# EAGLE design Power_3Escon_board_v2 (EAGLE 9.6.2)
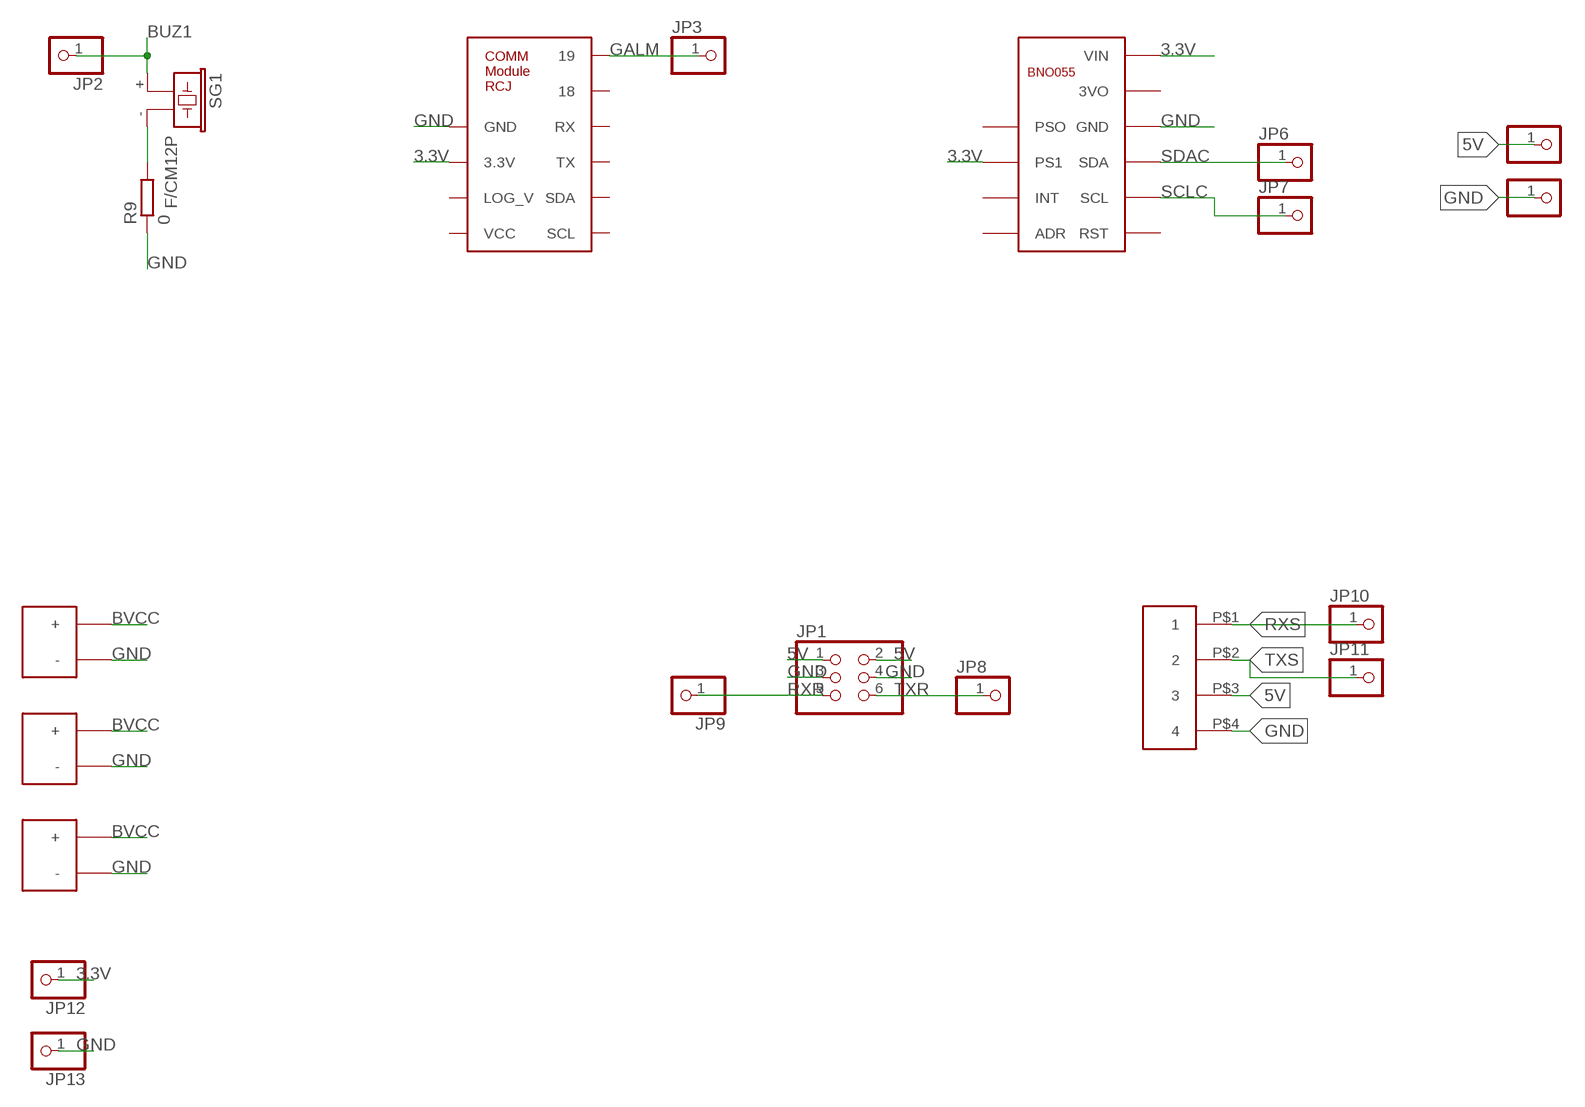
[diagram p0: schematic, sheet 1, part 1 of 3]
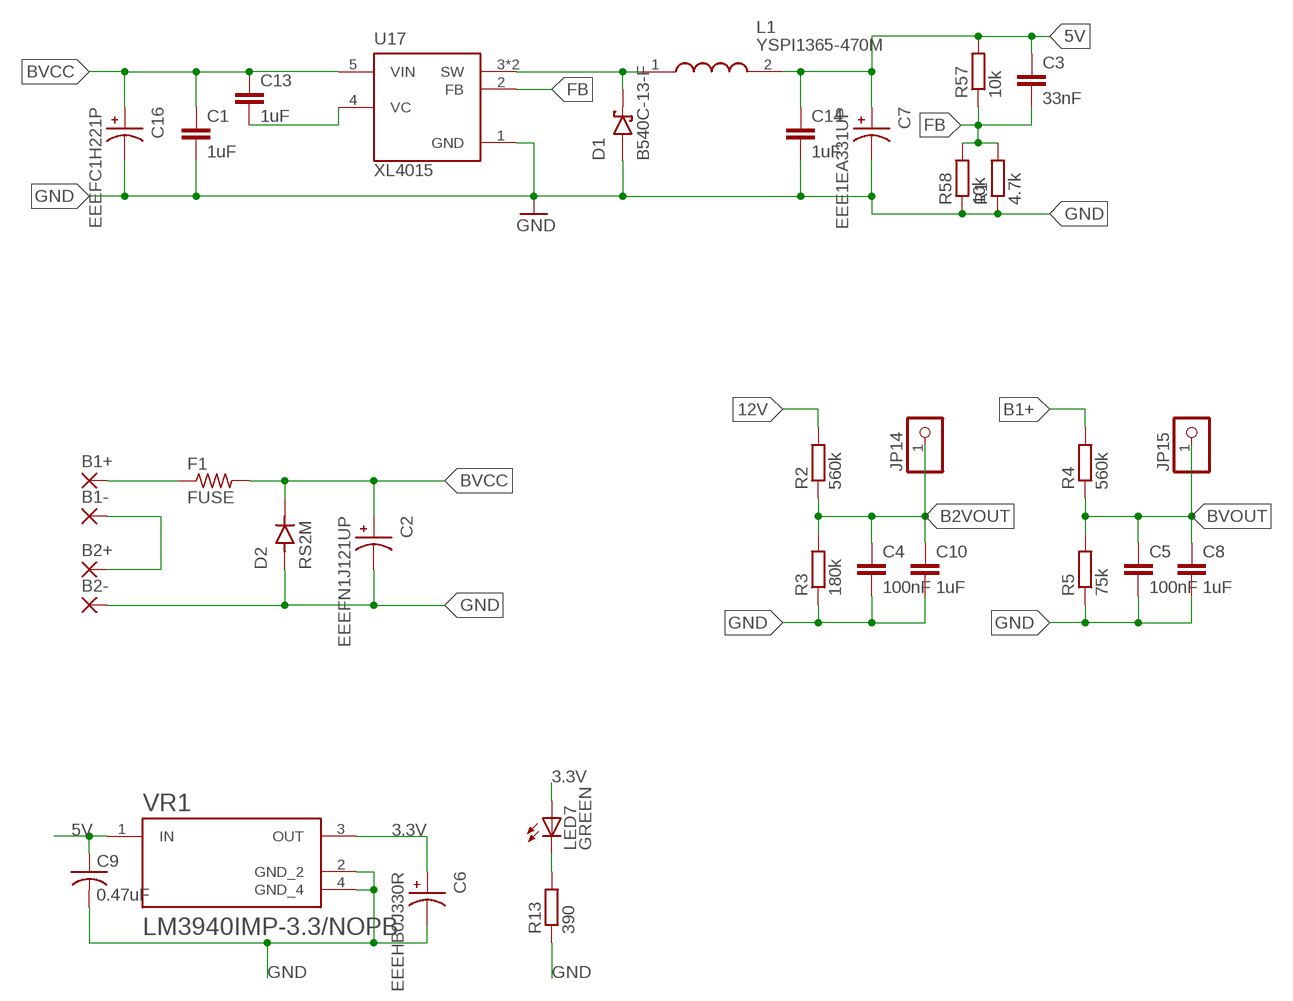
[diagram p1: schematic, sheet 1, part 2 of 3]
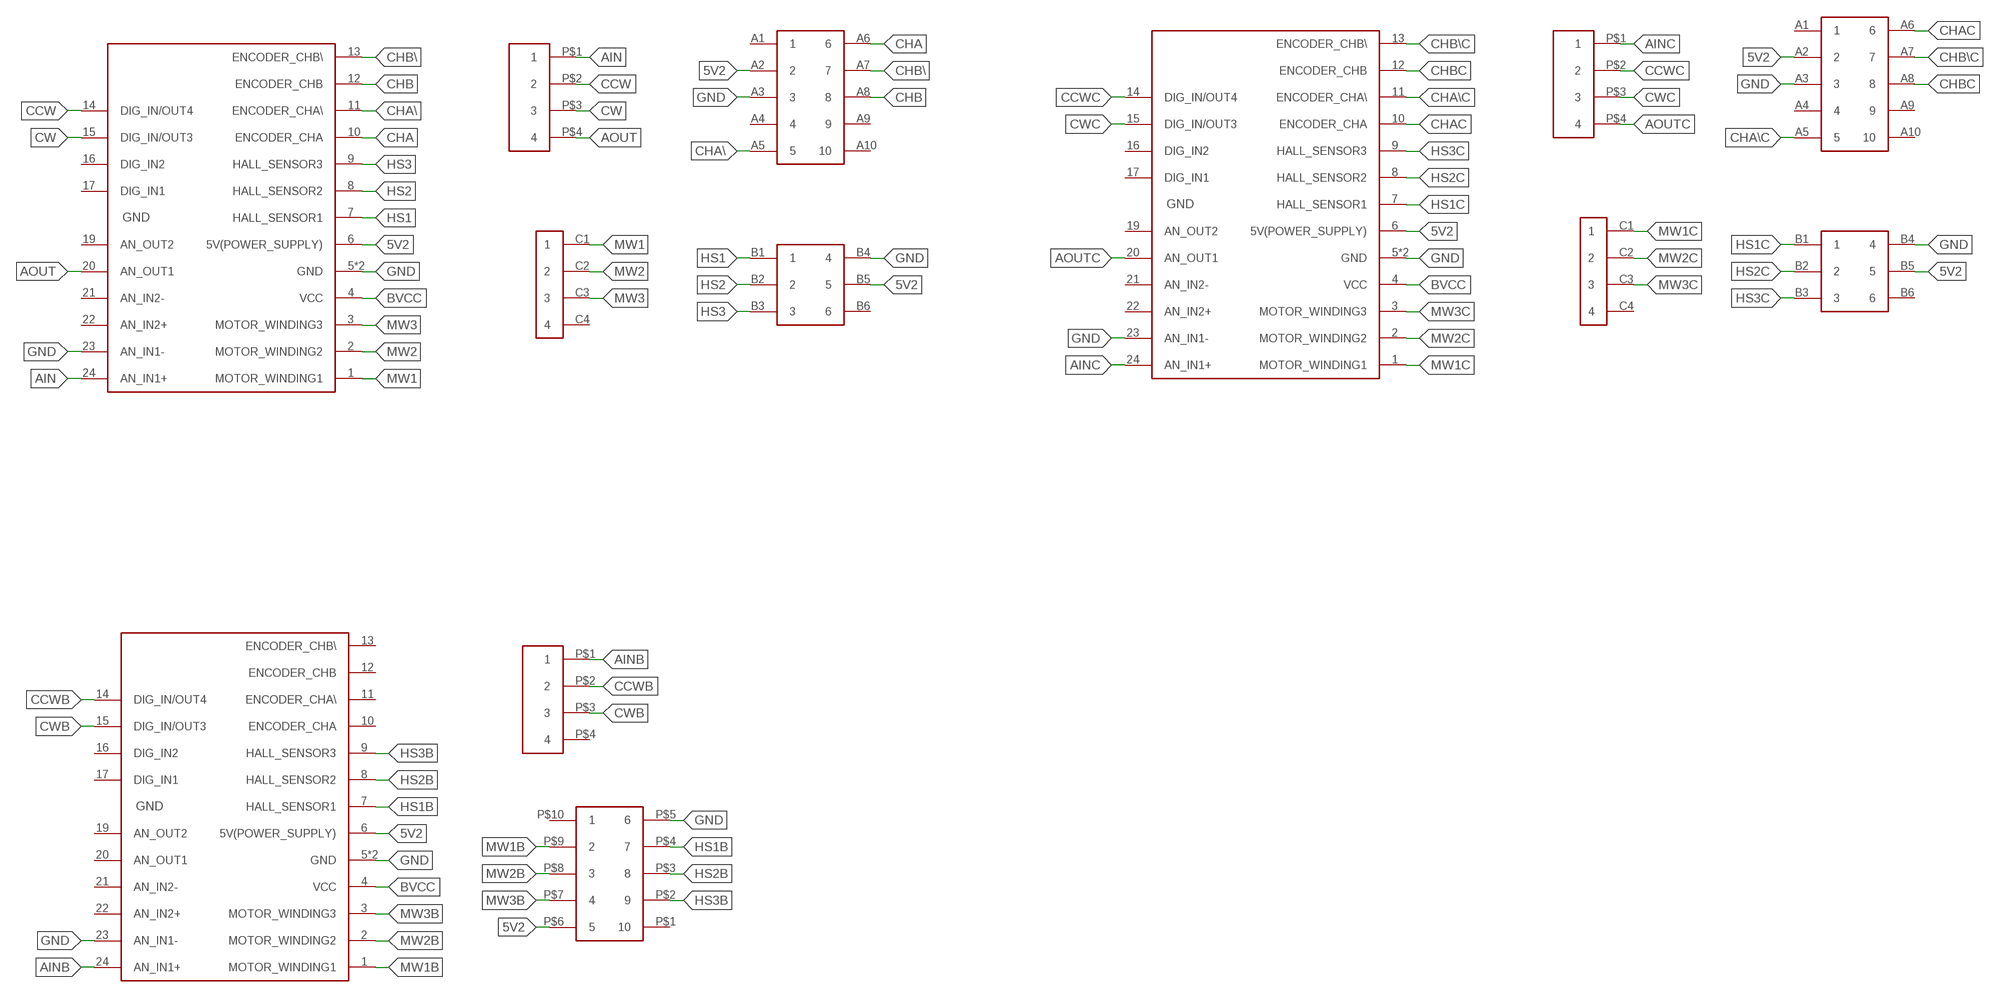
[diagram p2: schematic, sheet 1, part 3 of 3]

## Parts
B1+  3,81/1,4  [3,81/1,4]
B1-  3,81/1,4  [3,81/1,4]
B2+  3,81/1,4  [3,81/1,4]
B2-  3,81/1,4  [3,81/1,4]
C1  1uF  C-EUC0603  [C0603]
C2  EEEFN1J121UP  [CAP_EEEFN1J121UP]
C3  33nF  C-EUC0603  [C0603]
C4  100nF  C-EUC0603  [C0603]
C5  100nF  C-EUC0603  [C0603]
C6  EEEHB0J330R  [CAP_EEEHB0J330R]
C7  EEE1EA331UP  [CAP_EEE1EA331UP]
C8  1uF  C-EUC0603  [C0603]
C9  0.47uF  C-USC0603  [C0603]
C10  1uF  C-EUC0603  [C0603]
C13  1uF  C-EUC0603  [C0603]
C14  1uF  C-EUC0603  [C0603]
C16  EEEFC1H221P  [CAP_EEEFC1H221P]
D1  B540C-13-F  [DIOM6959X245N]
D2  RS2M  [DIOM4336X265N]
F1  FUSE  R-US_R1206  [R1206]
JP1  PINHD-2X3  [2X03]
JP2  PINHD-1X1  [1X01]
JP3  PINHD-1X1  [1X01]
JP4  PINHD-1X1  [1X01]
JP5  PINHD-1X1  [1X01]
JP6  PINHD-1X1  [1X01]
JP7  PINHD-1X1  [1X01]
JP8  PINHD-1X1  [1X01]
JP9  PINHD-1X1  [1X01]
JP10  PINHD-1X1  [1X01]
JP11  PINHD-1X1  [1X01]
JP12  PINHD-1X1  [1X01]
JP13  PINHD-1X1  [1X01]
JP14  PINHD-1X1  [1X01]
JP15  PINHD-1X1  [1X01]
L1  YSPI1365-470M  [INDPM138126X650N]
LED7  GREEN  LEDCHIPLED_0603  [CHIPLED_0603]
R1  4.7k  R-EU_R0603  [R0603]
R2  560k  R-EU_R0603  [R0603]
R3  180k  R-EU_R0603  [R0603]
R4  560k  R-EU_R0603  [R0603]
R5  75k  R-EU_R0603  [R0603]
R9  0  R-EU_R0603  [R0603]
R13  390  R-EU_R0603  [R0603]
R57  10k  R-EU_R0603  [R0603]
R58  10k  R-EU_R0603  [R0603]
SG1  F/CM12P  [F/CM12P]
U17  XL4015  [CONV_XL4015]
U$1  ESCON24/224/2  [ESCON24/2]
U$2  GAL_MODULE  [GAL_MODULE]
U$3  BNO055  [BNO055]
U$4  280378-2CONNECTOR  [280378-2CONNECTOR]
U$5  PIN2.54-2X5  [PIN2.54-2X5]
U$6  MX-44914-0601  [MX-44914-0601]
U$7  MX5566  [MX5566]
U$10  ESCON24/224/2  [ESCON24/2]
U$13  280378-2CONNECTOR  [280378-2CONNECTOR]
U$14  2,5MSF10  [2,5MSF10]
U$15  ESCON24/224/2  [ESCON24/2]
U$16  280378-2CONNECTOR  [280378-2CONNECTOR]
U$17  PIN2.54-2X5  [PIN2.54-2X5]
U$18  MX-44914-0601  [MX-44914-0601]
U$19  MX5566  [MX5566]
U$22  280378-2CONNECTOR  [280378-2CONNECTOR]
U$23  SVORKOVNICA3.5_P2  [SVORKOVNICA3.5]
U$24  SVORKOVNICA3.5_P2  [SVORKOVNICA3.5]
U$25  SVORKOVNICA3.5_P2  [SVORKOVNICA3.5]
VR1  LM3940IMP-3.3/NOPB  [VREG_LM3940IMP-3.3/NOPB]

## Nets
3.3V: C6.1 JP12.1 LED7.A U$2.3.3V U$3.PS1 U$3.VIN VR1.3(OUT)
5V: C3.1 C7.1 C9.1 C14.1 JP1.1 JP1.2 JP4.1 L1.2 R57.2 U$22.P$3 VR1.1(IN)
5V2: U$1.6(5V(POWER_SUPPLY)) U$5.A2 U$6.B5 U$10.6(5V(POWER_SUPPLY)) U$14.P$6 U$15.6(5V(POWER_SUPPLY)) U$17.A2 U$18.B5
12V: B1-.1(P) B2+.1(P) R2.2
AIN: U$1.24(AN_IN1+) U$4.P$1
AINB: U$10.24(AN_IN1+) U$13.P$1
AINC: U$15.24(AN_IN1+) U$16.P$1
AOUT: U$1.20(AN_OUT1) U$4.P$4
AOUTC: U$15.20(AN_OUT1) U$16.P$4
B1+: B1+.1(P) F1.1 R4.2
B2VOUT: C4.1 C10.1 JP14.1 R2.1 R3.2
BUZ1: JP2.1 SG1.+
BVCC: C1.1 C2.1 C13.1 C16.1 D2.C(K) F1.2 U17.5(VIN) U$1.4(VCC) U$10.4(VCC) U$15.4(VCC) U$23.P$1(+) U$24.P$1(+) U$25.P$1(+)
BVOUT: C5.1 C8.1 JP15.1 R4.1 R5.2
CCW: U$1.14(DIG_IN/OUT4) U$4.P$2
CCWB: U$10.14(DIG_IN/OUT4) U$13.P$2
CCWC: U$15.14(DIG_IN/OUT4) U$16.P$2
CHA: U$1.10(ENCODER_CHA) U$5.A6
CHA\\: U$1.11(ENCODER_CHA\\) U$5.A5
CHA\\C: U$15.11(ENCODER_CHA\\) U$17.A5
CHAC: U$15.10(ENCODER_CHA) U$17.A6
CHB: U$1.12(ENCODER_CHB) U$5.A8
CHB\\: U$1.13(ENCODER_CHB\\) U$5.A7
CHB\\C: U$15.13(ENCODER_CHB\\) U$17.A7
CHBC: U$15.12(ENCODER_CHB) U$17.A8
CW: U$1.15(DIG_IN/OUT3) U$4.P$3
CWB: U$10.15(DIG_IN/OUT3) U$13.P$3
CWC: U$15.15(DIG_IN/OUT3) U$16.P$3
FB: C3.2 R1.2 R57.1 R58.2 U17.2(FB)
GALM: JP3.1 U$2.19
GND: B2-.1(P) C1.2 C2.2 C4.2 C5.2 C6.2 C7.2 C8.2 C9.2 C10.2 C14.2 C16.2 D1.A D2.A JP1.3 JP1.4 JP5.1 JP13.1 R1.1 R3.1 R5.1 R9.1 R13.1 R58.1 U17.1(GND) U$1.5(GND) U$1.18(GND) U$1.23(AN_IN1-) U$2.GND U$3.GND U$5.A3 U$6.B4 U$10.5(GND) U$10.18(GND) U$10.23(AN_IN1-) U$14.P$5 U$15.5(GND) U$15.18(GND) U$15.23(AN_IN1-) U$17.A3 U$18.B4 U$22.P$4 U$23.P$2(-) U$24.P$2(-) U$25.P$2(-) VR1.2(GND_2) VR1.4(GND_4)
HS1: U$1.7(HALL_SENSOR1) U$6.B1
HS1B: U$10.7(HALL_SENSOR1) U$14.P$4
HS1C: U$15.7(HALL_SENSOR1) U$18.B1
HS2: U$1.8(HALL_SENSOR2) U$6.B2
HS2B: U$10.8(HALL_SENSOR2) U$14.P$3
HS2C: U$15.8(HALL_SENSOR2) U$18.B2
HS3: U$1.9(HALL_SENSOR3) U$6.B3
HS3B: U$10.9(HALL_SENSOR3) U$14.P$2
HS3C: U$15.9(HALL_SENSOR3) U$18.B3
MW1: U$1.1(MOTOR_WINDING1) U$7.C1
MW1B: U$10.1(MOTOR_WINDING1) U$14.P$9
MW1C: U$15.1(MOTOR_WINDING1) U$19.C1
MW2: U$1.2(MOTOR_WINDING2) U$7.C2
MW2B: U$10.2(MOTOR_WINDING2) U$14.P$8
MW2C: U$15.2(MOTOR_WINDING2) U$19.C2
MW3: U$1.3(MOTOR_WINDING3) U$7.C3
MW3B: U$10.3(MOTOR_WINDING3) U$14.P$7
MW3C: U$15.3(MOTOR_WINDING3) U$19.C3
N$5: LED7.C R13.2
N$7: C13.2 U17.4(VC)
N$16: R9.2 SG1.-
N$42: D1.C(K) L1.1 U17.3(SW) U17.3.1(SW)
RXR: JP1.5 JP9.1
RXS: JP10.1 U$22.P$1
SCLC: JP7.1 U$3.SCL
SDAC: JP6.1 U$3.SDA
TXR: JP1.6 JP8.1
TXS: JP11.1 U$22.P$2
Unconnected: U$1.16(DIG_IN2) U$1.17(DIG_IN1) U$1.19(AN_OUT2) U$1.21(AN_IN2-) U$1.22(AN_IN2+) U$2.18 U$2.LOG_VCC(LOG_V) U$2.RX U$2.SCL U$2.SDA U$2.TX U$2.VCC U$3.3VO U$3.ADR U$3.INT U$3.PS0(PSO) U$3.RST U$5.A1 U$5.A4 U$5.A9 U$5.A10 U$6.B6 U$7.C4 U$10.10(ENCODER_CHA) U$10.11(ENCODER_CHA\\) U$10.12(ENCODER_CHB) U$10.13(ENCODER_CHB\\) U$10.16(DIG_IN2) U$10.17(DIG_IN1) U$10.19(AN_OUT2) U$10.20(AN_OUT1) U$10.21(AN_IN2-) U$10.22(AN_IN2+) U$13.P$4 U$14.P$1 U$14.P$10 U$15.16(DIG_IN2) U$15.17(DIG_IN1) U$15.19(AN_OUT2) U$15.21(AN_IN2-) U$15.22(AN_IN2+) U$17.A1 U$17.A4 U$17.A9 U$17.A10 U$18.B6 U$19.C4

## Library data of the parts
B1+ B1- B2+ B2- = wirepad:3,81/1,4: THROUGH-HOLE PAD
C1 C3-C5 C8 C10 C13 C14 = rcl:C-EU: CAPACITOR, European symbol; SPICEPREFIX: C
C2 = EEEFN1J121UP:EEEFN1J121UP: Check availability <https://pricing.snapeda.com/parts/EEE-FN1J121UP/Panasonic%20Electronic%20Components/view-part?ref=eda>; AVAILABILITY: In Stock; CHECK_PRICES: https://www.snapeda.com/parts/EEE-FN1J121UP/Panasonic/view-part/?ref=eda; DESCRIPTION: Capacitor,63VDC, 120uF,SMD'Electrolytic | Panasonic Electronic Components EEE-FN1J121UP; MF: Panasonic Electronic Components; MP: EEE-FN1J121UP; PACKAGE: RADIAL-2 Panasonic; PRICE: None; PURCHASE-URL: https://www.snapeda.com/api/url_track_click_mouser/?unipart_id=4878607&manufacturer=Panasonic Electronic Components&part_name=EEE-FN1J121UP&search_term=eeefn1j121up; SNAPEDA_LINK: https://www.snapeda.com/parts/EEE-FN1J121UP/Panasonic/view-part/?ref=snap
C6 = EEEHB0J330R:EEEHB0J330R: Check availability <https://pricing.snapeda.com/parts/EEE-HB0J330R/Panasonic/view-part?ref=eda>; AVAILABILITY: In Stock; CHECK_PRICES: https://www.snapeda.com/parts/EEE-HB0J330R/Panasonic/view-part/?ref=eda; DESCRIPTION: Capacitor,Alum Electrolytic,Cap 33 uF,Tol 20%,Vol-Rtg 6.3 VDC,SMT,4x5.8,TR | Panasonic Electronic Components EEE-HB0J330R; MF: Panasonic; MP: EEE-HB0J330R; PACKAGE: RADIAL-2 Panasonic; PRICE: None; SNAPEDA_LINK: https://www.snapeda.com/parts/EEE-HB0J330R/Panasonic/view-part/?ref=snap
C7 = EEE1EA331UP:EEE1EA331UP: Check availability <https://pricing.snapeda.com/parts/EEE1EA331UP/Panasonic/view-part?ref=eda>; AVAILABILITY: In Stock; CHECK_PRICES: https://www.snapeda.com/parts/EEE1EA331UP/Panasonic/view-part/?ref=eda; DESCRIPTION: 330µF 25V Aluminum Electrolytic Capacitors Radial, Can - SMD 2000 Hrs @ 85°C; MF: Panasonic; MP: EEE1EA331UP; PACKAGE: RADIAL-2 Panasonic; PRICE: None; PURCHASE-URL: https://www.snapeda.com/api/url_track_click_mouser/?unipart_id=5784627&manufacturer=Panasonic&part_name=EEE1EA331UP&search_term= eee1ea331up; SNAPEDA_LINK: https://www.snapeda.com/parts/EEE1EA331UP/Panasonic/view-part/?ref=snap
C9 = adafruit:C-US: CAPACITOR, American symbol
C16 = EEEFC1H221P:EEEFC1H221P: Check availability <https://pricing.snapeda.com/parts/EEEFC1H221P/Panasonic/view-part?ref=eda>; AVAILABILITY: Not in stock; DESCRIPTION: 220µF 50V Aluminum Electrolytic Capacitors Radial, Can - SMD 1000 Hrs @ 105°C; MF: Panasonic; MP: EEEFC1H221P; PACKAGE: RADIAL-2 Panasonic; PRICE: None
D1 = B540C-13-F:B540C-13-F: Diode, Schottky, 5a, 40v, Do-214ab-2, Full Reel Check availability <https://pricing.snapeda.com/parts/B540C-13-F/Diodes%20Inc./view-part?ref=eda>; AVAILABILITY: In Stock; DESCRIPTION: Diode Schottky 40 V 5A Surface Mount SMC; MF: Diodes Inc.; MP: B540C-13-F; PACKAGE: DO-214 Diodes Inc.; PRICE: None; PURCHASE-URL: https://pricing.snapeda.com/search/part/B540C-13-F/?ref=eda
D2 = DO-214AA:RS2M: Check availability <https://pricing.snapeda.com/parts/RS2M/Taiwan%20Semiconductor/view-part?ref=eda>; AVAILABILITY: In Stock; CHECK_PRICES: https://www.snapeda.com/parts/RS2M/Taiwan+Semiconductor/view-part/?ref=eda; DESCRIPTION: 2A, 50V - 1000V Fast Recovery Surface Mount Rectifier; MF: Taiwan Semiconductor; MP: RS2M; PACKAGE: DO-214AA-2 Taiwan Semiconductor; PRICE: None; PURCHASE-URL: https://www.snapeda.com/api/url_track_click_mouser/?unipart_id=808913&manufacturer=Taiwan Semiconductor&part_name=RS2M&search_term=do-214aa-2; SNAPEDA_LINK: https://www.snapeda.com/parts/RS2M/Taiwan+Semiconductor/view-part/?ref=snap
F1 = adafruit:R-US_: RESISTOR, American symbol
JP1 = pinhead:PINHD-2X3: PIN HEADER
JP2-JP15 = pinhead:PINHD-1X1: PIN HEADER
L1 = YSPI1365-470M:YSPI1365-470M: YSPI1365-470M Source: Datasheet <https://datasheet.lcsc.com/lcsc/2003172239_YJYCOIN-YSPI1365-470M_C497913.pdf>; DESCRIPTION: YSPI1365-470M; HEIGHT: 6.5mm; MANUFACTURER_NAME: YJYCOIN; MANUFACTURER_PART_NUMBER: YSPI1365-470M
LED7 = adafruit:LED: LED OSRAM: - CHIPLED LG R971, LG N971, LY N971, LG Q971, LY Q971, LO R971, LY R971 LH N974, LH R974 LS Q976, LO Q976, LY Q976 LO Q996 - Hyper CHIPLED LW Q18S LB Q993, LB Q99A, LB R99A - SideLED LS A670, LO A670, LY A670, LG A670, LP A670 LB A673, LV A673, LT A673, LW A673 LH A674 LY A675 LS A676, LA A676, LO A676, LY A676, LW A676 LS A679, LY A679, LG A679 - Hyper Micro SIDELED® LS Y876, LA Y876, LO Y876, LY Y876 LT Y87S - SmartLED LW L88C, LW L88S LB L89C, LB L89S, LG L890 LS L89K, LO L89K, LY L89K LS L896, LA L896, LO L896, LY L896 - TOPLED LS T670, LO T670, LY T670, LG T670, LP T670 LSG T670, LSP T670, LSY T670, LOP T670, LYG T670 LG T671, LOG T671, LSG T671 LB T673, LV T673, LT T673, LW T673 LH T674 LS T676, LA T676, LO T676, LY T676, LB T676, LH T676, LSB T676, LW T676 LB T67C, LV T67C, LT T67C, LS T67K, LO T67K, LY T67K, LW E67C LS E67B, LA E67B, LO E67B, LY E67B, LB E67C, LV E67C, LT E67C LW T67C LS T679, LY T679, LG T679 LS T770, LO T770, LY T770, LG T770, LP T770 LB T773, LV T773, LT T773, LW T773 LH T774 LS E675, LA E675, LY E675, LS T675 LS T776, LA T776, LO T776, LY T776, LB T776 LHGB T686 LT T68C, LB T68C - Hyper Mini TOPLED® LB M676 - Mini TOPLED Santana® LG M470 LS M47K, LO M47K, LY M47K Source: http://www.osram.convergy.de/
R1-R5 R9 R13 R57 R58 = rcl:R-EU_: RESISTOR, European symbol; SPICEPREFIX: R
SG1 = buzzer:F/CM12P: BUZZER Source: Buerklin; OC_FARNELL: unknown; OC_NEWARK: unknown
U17 = XL4015:XL4015: 5A 180KHz 36V Buck DC to DC Converter Check availability <https://pricing.snapeda.com/parts/XL4015/XLSEMI/view-part?ref=eda>; AVAILABILITY: Not in stock; DESCRIPTION: 5A 180KHz 36V Buck DC to DC Converter; MF: XLSEMI; MP: XL4015; PACKAGE: None; PRICE: None
U$1 U$10 U$15 = ESCON_24-2:ESCON24/2
U$2 = GAL_Module:GAL_MODULE
U$3 = BNO055:BNO055
U$4 U$13 U$16 U$22 = 280378-2CONNECTOR:280378-2CONNECTOR: Signal connector: Male and Female connectors can be purchased at TME: https://www.tme.eu/gb/details/280378-2/raster-signal-connectors-2-54mm/te-connectivity/ https://www.tme.eu/gb/details/280359/raster-signal-connectors-2-54mm/te-connectivity/
U$5 U$17 = PIN2.54-2X5:PIN2.54-2X5: Connector for EC-FLAT45(encoder): Can be bought at gme.sk: https://www.gme.sk/v/1498388/kls-mlw10g-konektor-vidlice-roztec-254mm-2x5pinov-priama-do-dps
U$6 U$18 = MX-44914-0601:MX-44914-0601: Connector for EC-FLAT45(hall sensor): Can be bought trough tme.eu: https://www.tme.eu/gb/details/mx-44914-0601/other-connectors-molex/molex/449140601/
U$7 U$19 = MX5566:MX5566: Connector for EC-FLAT45(motor windings): Can be bought on gme.sk: https://www.gme.sk/v/1496575/molex-39-28-1043-mini-fit-vidlica-rozstup-42mm-2x2piny-priama-do-dps
U$14 = 2,5MSF10:2,5MSF10: Connector for EC-max22(dribbler): Can be bought on tme.eu: https://www.tme.eu/gb/details/2.5msf10/raster-signal-connectors-2-50mm/lumberg/2-5-msf-10/
U$23-U$25 = SVORKOVNICA3.5:SVORKOVNICA3.5_P2
VR1 = LM3940IMP-3.3_NOPB:LM3940IMP-3.3/NOPB: 1-A, low-dropout voltage regulator for 5-V to 3.3-V conversion 4-SOT-223 -40 to 125 Check availability <https://pricing.snapeda.com/parts/LM3940IMP-3.3/Texas%20Instruments/view-part?ref=eda>; AVAILABILITY: In Stock; CHECK_PRICES: https://www.snapeda.com/parts/LM3940IMP-3.3/Texas+Instruments/view-part/?ref=eda; DESCRIPTION: 1-A, low-dropout voltage regulator for 5-V to 3.3-V conversion 4-SOT-223 -40 to 125; MF: Texas Instruments; MP: LM3940IMP-3.3; PACKAGE: SOT-223-4 Texas Instruments; PRICE: None; PURCHASE-URL: https://www.snapeda.com/api/url_track_click_mouser/?unipart_id=50710&manufacturer=Texas Instruments&part_name=LM3940IMP-3.3&search_term=None; SNAPEDA_LINK: https://www.snapeda.com/parts/LM3940IMP-3.3/Texas+Instruments/view-part/?ref=snap

## Board
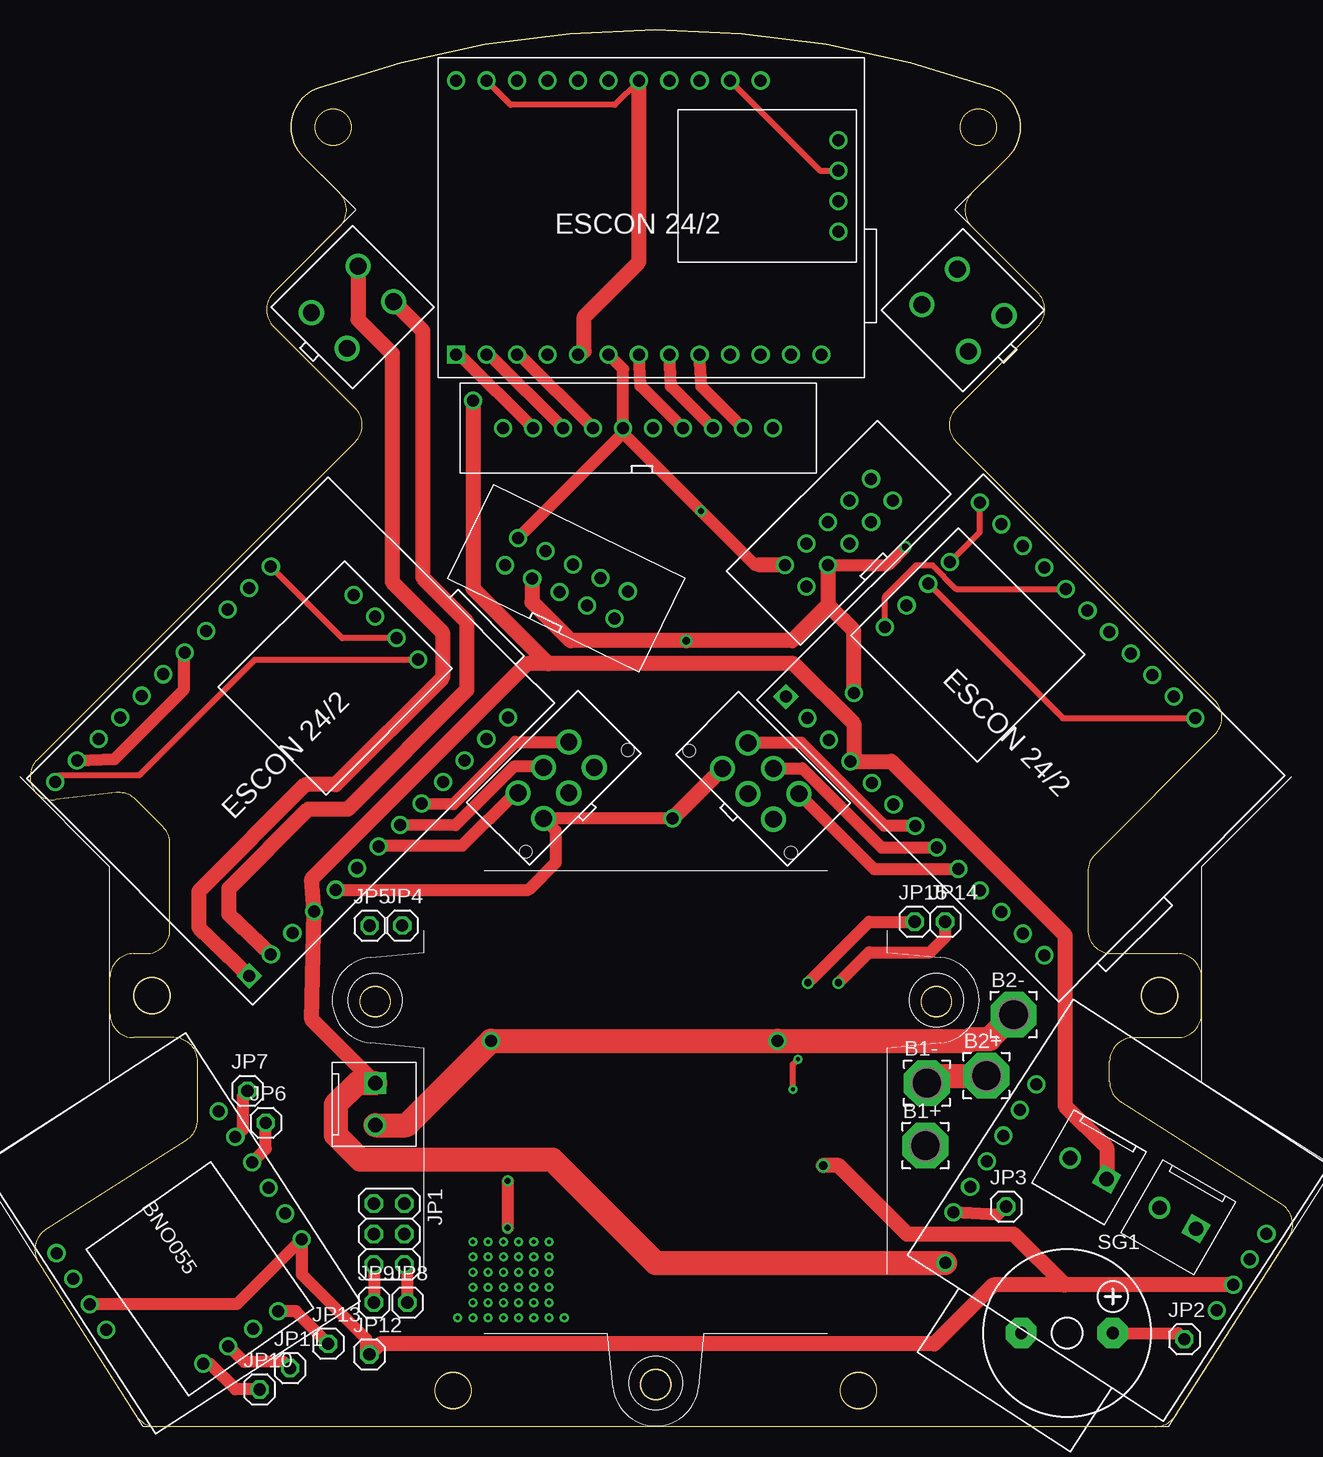
[diagram p3: board, top side]
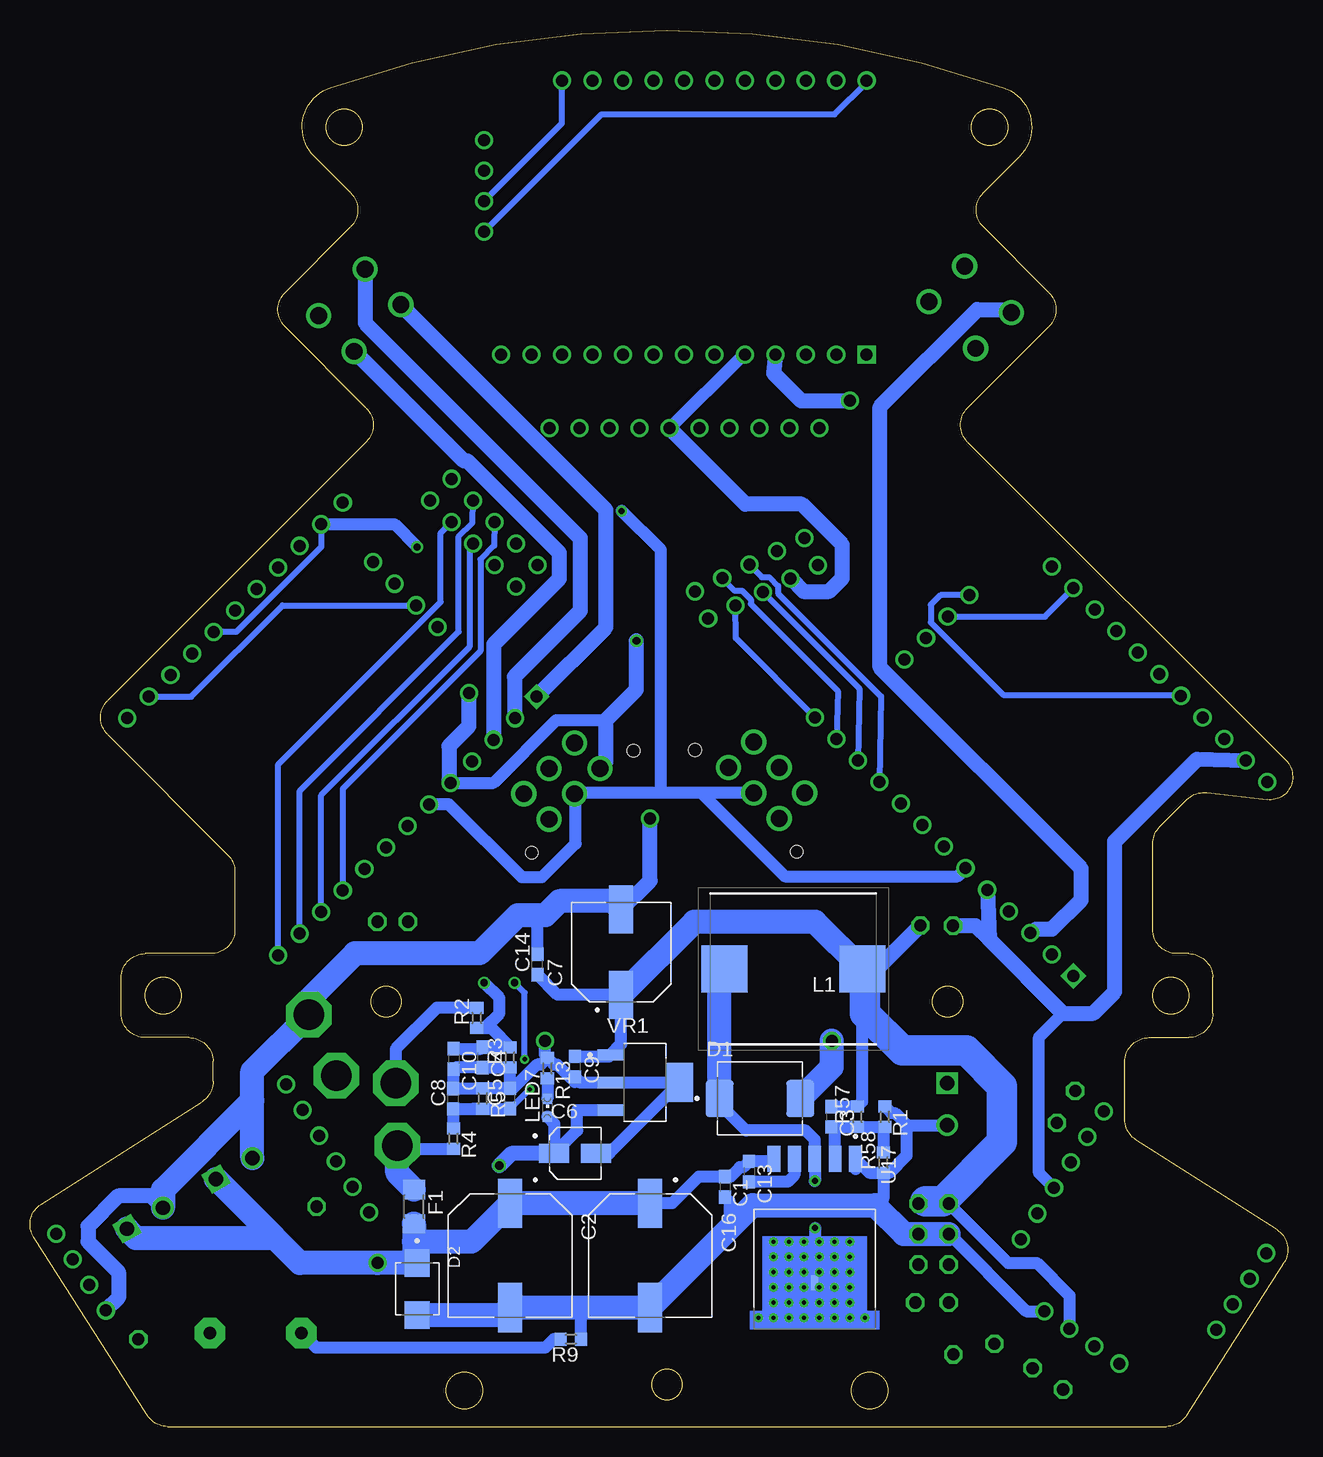
[diagram p4: board, bottom side, seen from below]

Size 105.26 x 116.42 mm. Coordinates in mm from the lower left corner, seen from the top.
Outline: 8.66,39.42 arc90 6.66,37.42 6.66,34.42 arc90 8.66,32.42 11.98,32.42 arc-90 13.98,30.42 13.98,25.59 arc-58 13.06,23.9 1.33,16.43 arc90 0.72,13.67 8.84,0.93 arc58 10.53,0 93.8,0 arc58 95.48,0.93 104.95,15.78 arc90 104.34,18.54 90.92,27.09 arc-58 90,28.77 90,30.42 arc-90 92,32.42 95.66,32.42 arc90 97.66,34.42 97.66,37.42 arc90 95.66,39.42 90.18,39.42 arc-90 88.18,41.42 88.18,46.25 arc-45 88.77,47.67 98.79,57.69 arc90 98.79,60.52 77.22,82.08 arc-90 77.22,84.91 84.01,91.7 arc90 84.01,94.53 78.53,100.01 arc-90 78.53,102.84 81.54,105.85 arc116 80.23,111.62 arc39 24.1,111.62 arc116 22.78,105.85 25.79,102.84 arc-90 25.79,100.01 20.31,94.53 arc90 20.31,91.7 27.1,84.91 arc-90 27.1,82.08 0.59,55.57 arc88 0.54,52.79 arc50 2.13,52.26 7.17,52.85 arc-52 8.81,52.27 11.08,50.01 arc-45 11.66,48.59 11.66,41.42 arc-90 9.66,39.42 8.66,39.42
Outline: circle at 35.26,3 radius 1.5
Outline: circle at 69.06,3 radius 1.5
Outline: circle at 75.56,35.42 radius 1.25
Outline: circle at 79.07,108.32 radius 1.5
Outline: circle at 52.16,3.5 radius 1.25
Outline: circle at 10.16,35.92 radius 1.5
Outline: circle at 25.26,108.32 radius 1.5
Outline: circle at 94.16,35.92 radius 1.5
Outline: circle at 28.76,35.42 radius 1.25
Copper layers (1*16): Top 0.035mm / dielectric 1.5mm / Bottom 0.035mm
Design rules "default": minimum track width 6mil, minimum drill 0.35mm, track to track 6mil, track to pad 6mil, pad to pad 6mil, via to via 6mil, smd to smd 6mil, copper to edge 40mil, drill to drill 6mil, minimum pad ring 10mil, minimum via ring 8mil, stop-mask expansion 4mil, vias tented up to drill 0mil, thermal gap 10mil
Holes 1.04 mm at 41.35,47.92 63.44,47.84 54.95,56.33 49.83,56.4

### Footprints (pad centres in the part's own frame; a part is rotated, then mirrored left to right if it is on the bottom)
3,81/1,4 = drill 2.54 pad 3.81 octagon: 1 0,0
C0603 = smd 1.1 x 1: 1 -0.85,0; 2 0.85,0
CAP_EEEFN1J121UP = smd 4.1 x 2: 1 -4.35,0; 2 4.35,0
CAP_EEEHB0J330R = smd 2.5 x 1.6: 1 -1.75,0; 2 1.75,0
CAP_EEE1EA331UP = smd 4 x 2: 1 -3.55,0; 2 3.55,0
CAP_EEEFC1H221P = smd 4.1 x 2: 1 -4.35,0; 2 4.35,0
DIOM6959X245N = smd 2.33 x 3.07: A 3.365,0; C -3.365,0
DIOM4336X265N = smd 2.28 x 2.12: A 2.165,0; C -2.165,0
R1206 = smd 1.6 x 1.803: 1 -1.422,0; 2 1.422,0
2X03 = drill 1.016 octagon: 1 -2.54,-1.27; 2 -2.54,1.27; 3 0,-1.27; 4 0,1.27; 5 2.54,-1.27; 6 2.54,1.27
1X01 = drill 1.016 octagon: 1 0,0
INDPM138126X650N = smd 3.85 x 3.9: 1 -5.75,0; 2 5.75,0
CHIPLED_0603 = smd 0.8 x 0.8: A 0,-0.75; C 0,0.75
R0603 = smd 1 x 1.1: 1 -0.85,0; 2 0.85,0
F/CM12P = drill 1.016 pad 2.54 octagon: + 3.81,0; - -3.81,0
CONV_XL4015 = smd 2.16 x 1.07: 1 -4.747,3.4; 2 -4.747,1.7; 3 -4.747,0; 4 -4.747,-1.7; 5 -4.747,-3.4 | smd 1.27 x 0.635: 3.1 5.588,0
ESCON24/2 = drill 1 square: 1 34.06,24.765 | drill 1: 2 31.52,24.765; 3 28.98,24.765; 4 26.44,24.765; 5 23.9,24.765; 6 21.36,24.765; 7 18.82,24.765; 8 16.28,24.765; 9 13.74,24.765; 10 11.2,24.765; 11 8.66,24.765; 12 6.12,24.765; 13 3.58,24.765; 14 8.66,1.905; 15 11.2,1.905; 16 13.74,1.905; 17 16.28,1.905; 18 18.82,1.905; 19 21.36,1.905; 20 23.9,1.905; 21 26.44,1.905; 22 28.98,1.905; 23 31.52,1.905; 24 34.06,1.905
GAL_MODULE = drill 1: 3.3V 1.27,12.7; 18 24.13,17.78; 19 24.13,20.32; GND 1.27,15.24; LOG_VCC 1.27,10.16; RX 24.13,15.24; SCL 24.13,7.62; SDA 24.13,10.16; TX 24.13,12.7; VCC 1.27,7.62
BNO055 = drill 1: 3VO 9.525,1.27; ADR 17.145,19.05; GND 12.065,1.27; INT 14.605,19.05; PS0 9.525,19.05; PS1 12.065,19.05; RST 19.685,1.27; SCL 17.145,1.27; SDA 14.605,1.27; VIN 6.985,1.27
280378-2CONNECTOR = drill 1: P$1 0,0; P$2 2.54,0; P$3 5.08,0; P$4 7.62,0
PIN2.54-2X5 = drill 1: A1 0,0; A2 0,2.54; A3 2.54,0; A4 2.54,2.54; A5 5.08,0; A6 5.08,2.54; A7 7.62,0; A8 7.62,2.54; A9 10.16,0; A10 10.16,2.54
MX-44914-0601 = drill 1.4: B1 6,0; B2 3,0; B3 0,0; B4 6,3; B5 3,3; B6 0,3 | hole 1.04: -3,3.94; 9,3.94
MX5566 = drill 1.4: C1 4.2,0; C2 0,0; C3 4.2,5.5; C4 0,5.5
2,5MSF10 = drill 1: P$1 0,0; P$2 2.5,0; P$3 5,0; P$4 7.5,0; P$5 10,0; P$6 12.5,0; P$7 15,0; P$8 17.5,0; P$9 20,0; P$10 22.5,0
SVORKOVNICA3.5 = drill 1.2 square: P$1 0,0 | drill 1.2: P$2 3.5,0
VREG_LM3940IMP-3.3/NOPB = smd 2.15 x 0.95: 1 -2.9,2.3; 2 -2.9,0; 3 -2.9,-2.3 | smd 2.15 x 3.25: 4 2.9,0

### Placement (x,y rotation side)
B1+  74.64,23.41 0 top
B1-  74.77,28.62 0 top
B2+  79.72,29.25 0 top
B2-  82.01,34.33 0 top
C1  47.34,19.98 270 bottom
C2  65.24,14.27 270 bottom
C3  38.45,25.83 270 bottom
C4  67.53,30.78 270 bottom
C5  65.24,27.35 90 bottom
C6  59.81,22.77 0 bottom
C7  55.97,39.54 90 bottom
C8  69.97,27.32 90 bottom
C9  59.84,30 270 bottom
C10  69.94,30.65 270 bottom
C13  45.3,21.25 270 bottom
C14  62.96,38.53 90 bottom
C16  53.56,14.27 270 bottom
D1  44.42,27.35 0 bottom
D2  72.99,11.47 270 bottom
F1  73.24,18.33 270 bottom
JP1  29.94,16.05 270 top
JP2  96.23,7.28 0 top
JP3  81.37,18.33 0 top
JP4  31.03,41.77 0 top
JP5  28.31,41.75 0 top
JP6  19.65,25.32 0 top
JP7  18.13,27.98 0 top
JP8  31.46,10.33 0 top
JP9  28.67,10.33 0 top
JP10  19.14,3.09 0 top
JP11  21.68,4.87 0 top
JP12  28.29,6.01 0 top
JP13  24.86,6.9 0 top
JP14  76.29,42.08 0 top
JP15  73.75,42.08 0 top
L1  41.62,38.14 0 bottom
LED7  62.13,26.57 0 bottom
R1  34,25.83 270 bottom
R2  68.01,34.07 90 bottom
R3  65.24,30.78 90 bottom
R4  69.96,24 270 bottom
R5  67.53,27.35 270 bottom
R9  60.16,7.28 180 bottom
R13  62.13,29.87 270 bottom
R57  36.29,25.83 90 bottom
R58  34.13,22.02 90 bottom
SG1  86.45,7.79 0 top
U17  39.84,17.57 270 bottom
U$1  24.86,79.17 225 top
U$2  108.3,21.76 147 top
U$3  27.52,10.46 123 top
U$4  32.35,63.93 135 top
U$5  39.59,71.8 334 top
U$6  44.92,57.07 225 top
U$7  30.32,93.77 135 top
U$10  69.57,114.11 180 top
U$13  67.4,99.61 90 top
U$14  61.94,83.23 180 top
U$15  104.61,54.27 135 top
U$16  76.67,72.05 225 top
U$17  64.74,70.02 45 top
U$18  64.1,52.75 135 top
U$19  77.32,96.49 225 top
U$22  14.44,5.25 35 top
U$23  28.79,28.62 270 top
U$24  89.76,20.64 150 top
U$25  97.19,16.49 150 top
VR1  53.97,28.69 0 bottom

### Tracks (layer width: path | path; a pad name or v marks a point on that pad's centre or on a via)
3.3V  (via drill 0.7)
  Top 1.016: JP12.1 28.03,6.27 28.03,7.3 22.66,12.68 U$3.VIN 17.23,10.2 U$3.PS1
  Top 1.27: v66.13,21.76 67.4,21.76 73.1,16.06 81.99,16.06 86.25,11.8 | U$2.3.3V 86.25,11.8 | 86.25,11.8 80.3,11.8 75.38,6.88 29.15,6.88 JP12.1
  Bottom 1.016: 62.1,25.85 LED7.A 61.56,25.25 C6.1 59.64,24.69 59.64,26.39 VR1.3
  Bottom 1.27: C6.1 65.12,22.77 v66.13,21.76
5V
  Bottom 1.016: C3.1 R57.2 35.87,27.09 35.87,34.24 35.65,34.46 | C9.1 57.01,30.85 VR1.1 55.97,31.89 C7.1 61.27,35.99 C14.1 | U$22.P$3 18.61,10.91 21.34,13.65 23.73,13.65 JP1.1 28.86,18.78 29.16,18.78 | 44.92,42.46 44.54,42.08 | JP1.2 30.83,18.59 30.63,18.78
  Bottom 1.27: L1.2 34.66,38.14 JP4.1
  Bottom 2: L1.2 39.81,42.08 44.54,42.08 49.88,42.08 C7.1
  Bottom 2.54: L1.2 35.65,37.93 35.65,34.46 32.54,31.35 27.2,31.35 24.22,28.37 24.22,23.72 29.16,18.78 30.63,18.78
5V2  (via drill 0.5)
  Top 1.016: 49.44,88.14 U$10.6 | U$5.A2 49.44,82.82 | 49.44,82.82 U$14.P$6 49.44,88.14 | 49.44,88.14 | 60.8,71.83 60.43,71.83 v55.93,76.33 49.44,82.82
  Top 1.27: U$17.A2 60.8,71.83
  Bottom 1.016: U$15.6 70.35,51.87 64.28,45.8 62.59,45.8 59.78,48.6 59.78,52.82 | U$6.B5 49.28,52.82 | 49.28,52.82 52.67,52.82 | 52.67,52.82 59.78,52.82 | 59.78,52.82 U$18.B5 | U$1.6 27.94,45.87 42.33,45.87 49.28,52.82 | 52.67,52.82 52.67,73.07 v55.93,76.33
12V
  Top 2: B1-.1 75.4,29.25 B2+.1
  Bottom 1.016: B1-.1 74.78,28.63 74.78,31.47 71.33,34.92 R2.2
AIN
  Top 0.508: U$1.24 2.42,54.28 9.12,54.28 18.76,63.93 U$4.P$1
AINB
  Bottom 0.508: U$13.P$1 57.62,109.39 38.19,109.39 35.55,112.03 U$10.24
AINC
  Top 0.508: U$16.P$1 79.18,74.56 U$15.24
AOUT
  Bottom 0.508: U$4.P$4 | U$4.P$4 29.37,69.31 30.17,68.51 30.17,67.04 24.12,60.99 9.22,60.99 U$1.20
AOUTC
  Top 0.508: U$16.P$4 | U$16.P$4 71.29,69.2 73.89,71.8 75.23,71.8 77.2,69.83 U$15.20
B1+
  Bottom 1.016: B1+.1 74.38,23.15 R4.2
  Bottom 2: F1.1 74.64,21.15 B1+.1
B2VOUT  (via drill 0.6)
  Top 1.016: v67.4,37 69.94,39.54 75.02,39.54 76.29,40.81 JP14.1
  Bottom 1.016: v67.4,37 66.13,35.73 66.13,34.46 67.37,33.22 R2.1 66.84,33.22 R3.2 C4.1 67.66,31.5 C10.1
BUZ1
  Top 1.016: SG1.+ 95.72,7.79 JP2.1
BVCC  (via drill 1)
  Top 1.27: U$23.P$1 23.48,33.93 U$1.4 23.48,45.66 41.43,63.6 43.19,63.6 | 43.19,63.6 63.66,63.6 68.67,58.59 68.67,55.72 U$15.4 71.81,55.46 86.29,40.98 86.29,26.74 89.76,23.27 U$24.P$1 | v36.92,85.52 36.92,69.87 43.19,63.6
  Top 2: U$23.P$1 27.27,28.62 25.49,26.84 25.49,24.3 27.52,22.27 43.53,22.27 52.16,13.64 v76.29,13.64
  Bottom 1.016: U17.5 43.46,22.1 C13.1 45.79,21.61 46.08,21.61 46.86,20.83 C1.1 47.35,20.85 49.51,20.85 51.74,18.62 C16.1
  Bottom 1.27: U$10.4 43.26,87.8 40.98,85.52 v36.92,85.52
  Bottom 2: F1.2 73.24,15.41 | 73.24,15.41 73.24,13.89 D2.C v76.29,13.64 82.78,13.64 84.87,15.73 | C16.1 C2.1 68.45,15.41 73.24,15.41 | U$24.P$1 84.84,15.73 84.87,15.73 | U$25.P$1 96.44,15.73 84.87,15.73
BVOUT  (via drill 0.35, 0.6)
  Top 0.508: v63.59,28.11 63.59,30.2 v64.02,30.62
  Top 1.016: v64.86,37 69.94,42.08 JP15.1
  Bottom 0.508: C5.1 63.63,28.11 v63.59,28.11 | v64.02,30.62 64.02,36.16 v64.86,37
  Bottom 1.016: R5.2 68.31,26.5 | R5.2 C5.1 | R5.2 67.56,26.47 C8.1 69.96,26.46 R4.1
CCW
  Top 0.508: U$4.P$2 26.04,65.72 U$1.14
CCWB
  Bottom 0.508: U$13.P$2 60.92,108.63 U$10.14
CCWC
  Top 0.508: U$16.P$2 86.08,59.05 U$15.14
CHA
  Bottom 0.508: U$1.10 34.32,60.87 42.89,69.45 42.89,70.07 43.62,70.8 44.25,70.8 U$5.A6
CHA\\
  Bottom 0.508: U$5.A5 36.12,61.53 U$1.11
CHA\\C
  Bottom 0.508: U$15.11 80.98,52.64 68.62,64.99 68.62,73.32 U$17.A5
CHAC
  Bottom 0.508: U$17.A6 66.57,73.43 67.71,72.29 67.71,64.64 79.18,53.16 U$15.10
CHB
  Bottom 0.508: U$1.12 37.93,61.34 45.17,68.58 45.17,68.94 45.9,69.68 46.52,69.68 U$5.A8
CHB\\
  Bottom 0.508: U$1.13 46.42,65.73 U$5.A7
CHB\\C
  Bottom 0.508: U$15.13 84.57,55.2 71.03,68.74 71.03,74.5 U$17.A7
CHBC
  Bottom 0.508: U$15.12 82.77,53 69.52,66.26 69.52,74.2 68.38,75.34 U$17.A8
CW
  Bottom 0.508: U$4.P$3 20.65,67.52 U$1.15
CWB
  Top 0.508: U$10.15 65.84,104.69 U$13.P$3
CWC
  Bottom 0.508: U$15.15 91.82,60.85 84.2,68.46 U$16.P$3
FB
  Bottom 1.016: U17.2 38.14,24.67 C3.2 R57.1 R1.2 34.13,24.85 R58.2
GALM
  Top 1.016: JP3.1 80.68,17.64 U$2.19
GND  (via drill 0.6, 0.65, 1)
  Top 0.508: U$10.18 48.73,110.19 40.07,110.19 U$10.23
  Top 1.016: U$1.5 41.55,44.75 43.82,47.02 43.82,49.69 U$6.B4 v53.57,50.7 | U$1.23 7.05,55.64 12.79,61.39 12.79,64.55 U$1.18 | v72.99,73.32 71.46,71.8 66.54,71.8 | JP13.1 22.15,9.61 U$22.P$4
  Top 1.27: U$10.5 46.19,89.62 46.19,92.5 50.76,97.07 U$10.18 | U$5.A3 41.84,70.65 41.84,68.73 45.07,65.51 v54.7,65.51 63.55,65.51 66.54,68.49 | U$17.A3 66.54,71.8 66.54,68.49 | v68.67,61.13 68.67,66.36 66.54,68.49 | v53.57,50.7 U$18.B4
  Top 2: U$23.P$2 31.39,25.12 v38.42,32.15 v62.32,32.15 78.3,32.15 78.46,32.31 79.98,32.31 B2-.1
  Bottom 0.508: U$15.23 80.98,73.32 88.06,66.23 U$15.18 | U$15.18
  Bottom 1.016: U$14.P$5 45.91,89.22 U$10.5 | U$15.23 74.88,75.21 v72.99,73.32 | 46.94,16.54 46.94,18.74 C1.2 | R1.1 33.46,26.14 33.18,26.14 32.16,25.12 | 32.16,25.12 U$23.P$2 | C5.2 R5.1 67.56,28.17 C8.2 69.97,29.77 C10.2 69.82,29.93 C4.2 | C4.2 R3.1 C5.2 | 64.99,28.41 64.98,28.39 65.17,28.2 | C5.2 65.17,28.2 | R13.1 61.59,30.18 61.31,30.18 60.27,29.15 | 60.27,29.15 C9.2 59.38,28.69 VR1.2 VR1.4 56.99,22.77 C6.2 | 59.84,28.72 60.27,29.15 | C4.2 67.55,29.91 | JP1.3 22.23,9.61 U$22.P$4 | R58.1 34.13,18.97 34.64,18.45 34.82,18.45 | R58.1 35.29,21.17 U17.1 36.44,21.47 | R58.1 33.59,21.17 32.16,22.59 32.16,25.12 | R9.1 59.31,9.12 58.51,9.92 | 19.14,34.46 21.15,32.45 21.15,21.15 U$3.GND | R13.1 62.32,30.91 v62.32,32.15 | C14.2 62.96,41.99 62.32,42.62 | 57.24,58.88 61.4,58.88 66.63,53.65 U$15.5 | R13.1 62.67,30.18 62.99,30.18 64.97,28.2 65.17,28.2
  Bottom 1.27: U$1.5 25.29,40.61 | U$1.23 7.97,55.64 14.82,48.78 14.82,36.24 16.6,34.46 19.14,34.46 25.29,40.61 | U$14.P$5 45.63,76.88 40.91,76.88 37.54,73.51 37.54,70.73 38.65,69.63 40.79,69.63 41.83,70.67 U$5.A3 | U$25.P$2 95.15,19.22 97.91,19.22 100.42,16.71 100.42,15.41 97.88,12.87 97.88,10.74 U$2.GND | v68.67,61.13 68.67,58.38 70.34,56.72 70.34,53.8 U$15.5 | C7.2 53.57,45.49 v53.57,50.7 | U$18.B4 57.24,55.36 57.24,58.88 54.7,61.42 v54.7,65.51 | 25.29,40.61 26.43,41.75 JP5.1
  Bottom 2: D2.A 65.85,9.31 C2.2 58.51,9.92 C16.2 46.94,16.54 45.03,18.45 34.82,18.45 32.42,16.05 JP1.4 JP1.3 | U$24.P$2 86.72,27.19 | 86.72,27.19 86.72,29.62 B2-.1 82.01,35.6 78.17,39.45 67.78,39.45 64.61,42.62 62.32,42.62 61.13,43.81 56.69,43.81 C7.2 | 86.72,27.19 94.16,19.75 U$25.P$2 | D1.A 38.42,29.98 v38.42,32.15
HS1
  Top 1.016: U$1.7 29.01,48.43 36.03,48.43 40.43,52.82 U$6.B1
HS1B
  Top 1.016: U$14.P$4 50.88,86.76 U$10.7
HS1C
  Top 1.016: U$15.7 71.23,50.07 64.3,56.99 U$18.B1
HS2
  Top 1.016: U$1.8 35.44,50.11 40.35,55.02 42.73,55.02 U$6.B2
HS2B
  Top 1.016: U$14.P$3 53.42,86.73 U$10.8
HS2C
  Top 1.016: U$18.B2 64.39,54.87 70.99,48.27 U$15.8
HS3
  Top 1.016: U$1.9 35.31,51.9 40.48,57.07 U$6.B3
HS3B
  Top 1.016: U$14.P$2 55.96,86.7 U$10.9
HS3C
  Top 1.016: U$18.B3 70.37,46.48 U$15.9
MW1
  Top 1.27: U$7.C1 27.35,92.3 30.19,89.45 30.19,70.4 34.38,66.21 34.38,62.4 25.49,53.51 22.95,53.51 14.06,44.62 14.06,41.61 U$1.1
MW1B
  Top 1.016: U$14.P$9 35.93,89.17 U$10.1
MW1C
  Bottom 1.27: U$15.1 57.24,66.62 57.24,76.42 U$19.C1
MW2
  Top 1.27: U$1.2 16.6,42.66 16.6,44.88 23.21,51.48 26.51,51.48 36.41,61.39 36.41,67.1 32.73,70.78 32.73,91.36 U$7.C2
MW2B
  Top 1.016: U$14.P$8 38.43,89.18 U$10.2
MW2C
  Bottom 1.27: U$19.C2 77.32,92 59.4,74.09 59.4,67.99 64.87,62.52 64.87,59.11 U$15.2
MW3
  Bottom 1.27: U$1.3 21.39,41.46 20.06,41.46 17.64,43.88 17.64,46.52 34.4,63.29 34.4,85.02 26.3,93.12 23.72,93.12 U$7.C3
MW3B
  Top 1.016: U$14.P$7 40.92,89.2 U$10.3
MW3C
  Bottom 1.27: U$19.C3 69.11,80.51 68.81,80.51 61.15,72.85 61.15,70.66 66.61,65.2 U$15.3
N$2  (via drill 0.35)
  other vias: 38.19,14.14
N$3  (via drill 0.35)
  other vias: 39.46,14.14
N$4  (via drill 0.35)
  other vias: 40.73,14.14
N$5
  Bottom 1.016: R13.2 LED7.C
N$6  (via drill 0.35)
  other vias: 42,14.14
N$7
  Bottom 1.016: U17.4 41.54,20.95 42.09,20.4 C13.2
N$8  (via drill 0.35)
  other vias: 43.27,14.14
N$9  (via drill 0.35)
  other vias: 43.27,12.87
N$10  (via drill 0.35)
  other vias: 42,12.87
N$11  (via drill 0.35)
  other vias: 40.73,12.87
N$12  (via drill 0.35)
  other vias: 39.46,12.87
N$13  (via drill 0.35)
  other vias: 38.19,12.87
N$14  (via drill 0.35)
  other vias: 36.92,12.87
N$15  (via drill 0.35)
  other vias: 36.92,11.6
N$16
  Bottom 1.016: R9.2 61.61,7.28 62.32,6.57 81.42,6.57 SG1.-
N$17  (via drill 0.35)
  other vias: 38.19,11.6
N$18  (via drill 0.35)
  other vias: 39.46,11.6
N$19  (via drill 0.35)
  other vias: 40.73,11.6
N$20  (via drill 0.35)
  other vias: 42,11.6
N$21  (via drill 0.35)
  other vias: 43.27,11.6
N$22  (via drill 0.35)
  other vias: 43.27,10.33
N$23  (via drill 0.35)
  other vias: 42,10.33
N$24  (via drill 0.35)
  other vias: 40.73,10.33
N$25  (via drill 0.35)
  other vias: 39.46,10.33
N$26  (via drill 0.35)
  other vias: 38.19,10.33
N$27  (via drill 0.35)
  other vias: 36.92,10.33
N$28  (via drill 0.35)
  other vias: 36.92,9.06
N$29  (via drill 0.35)
  other vias: 38.19,9.06
N$30  (via drill 0.35)
  other vias: 39.46,9.06
N$31  (via drill 0.35)
  other vias: 40.73,9.06
N$32  (via drill 0.35)
  other vias: 42,9.06
N$33  (via drill 0.35)
  other vias: 43.27,9.06
N$34  (via drill 0.35)
  other vias: 44.54,9.06
N$35  (via drill 0.35)
  other vias: 35.65,9.06
N$36  (via drill 0.35)
  other vias: 36.92,15.41
N$37  (via drill 0.35)
  other vias: 38.19,15.41
N$38  (via drill 0.35)
  other vias: 39.46,15.41
N$39  (via drill 0.35)
  other vias: 40.73,15.41
N$40  (via drill 0.35)
  other vias: 42,15.41
N$41  (via drill 0.35)
  other vias: 43.27,15.41
N$42  (via drill 0.5)
  Top 1.016: v39.83,20.48 39.82,20.47 v39.82,16.55
  Bottom 1.016: D1.C 47.78,26.9 45.56,24.68 40.61,24.68 39.84,23.92 U17.3 v39.84,20.48 v39.83,20.48 | v39.82,16.55 39.82,15.48 39.84,15.46 U17.3.1
  Bottom 2: D1.C 47.78,37.74 L1.1
N$43  (via drill 0.35)
  other vias: 36.92,14.14
RXR
  Top 1.016: JP1.5 JP9.1
RXS
  Top 1.016: U$22.P$1 14.97,5.25 17.13,3.09 JP10.1
SCLC
  Top 1.016: U$3.SCL 17.75,24.77 17.75,27.6 JP7.1
SDAC
  Top 1.016: U$3.SDA 19.65,23.16 JP6.1
TXR
  Top 1.016: JP8.1 31.46,13.25 JP1.6
TXS
  Top 1.016: U$22.P$2 16.54,6.7 17.86,5.39 21.16,5.39 JP11.1